# Altium project Luxlogger_V2.PrjPcb
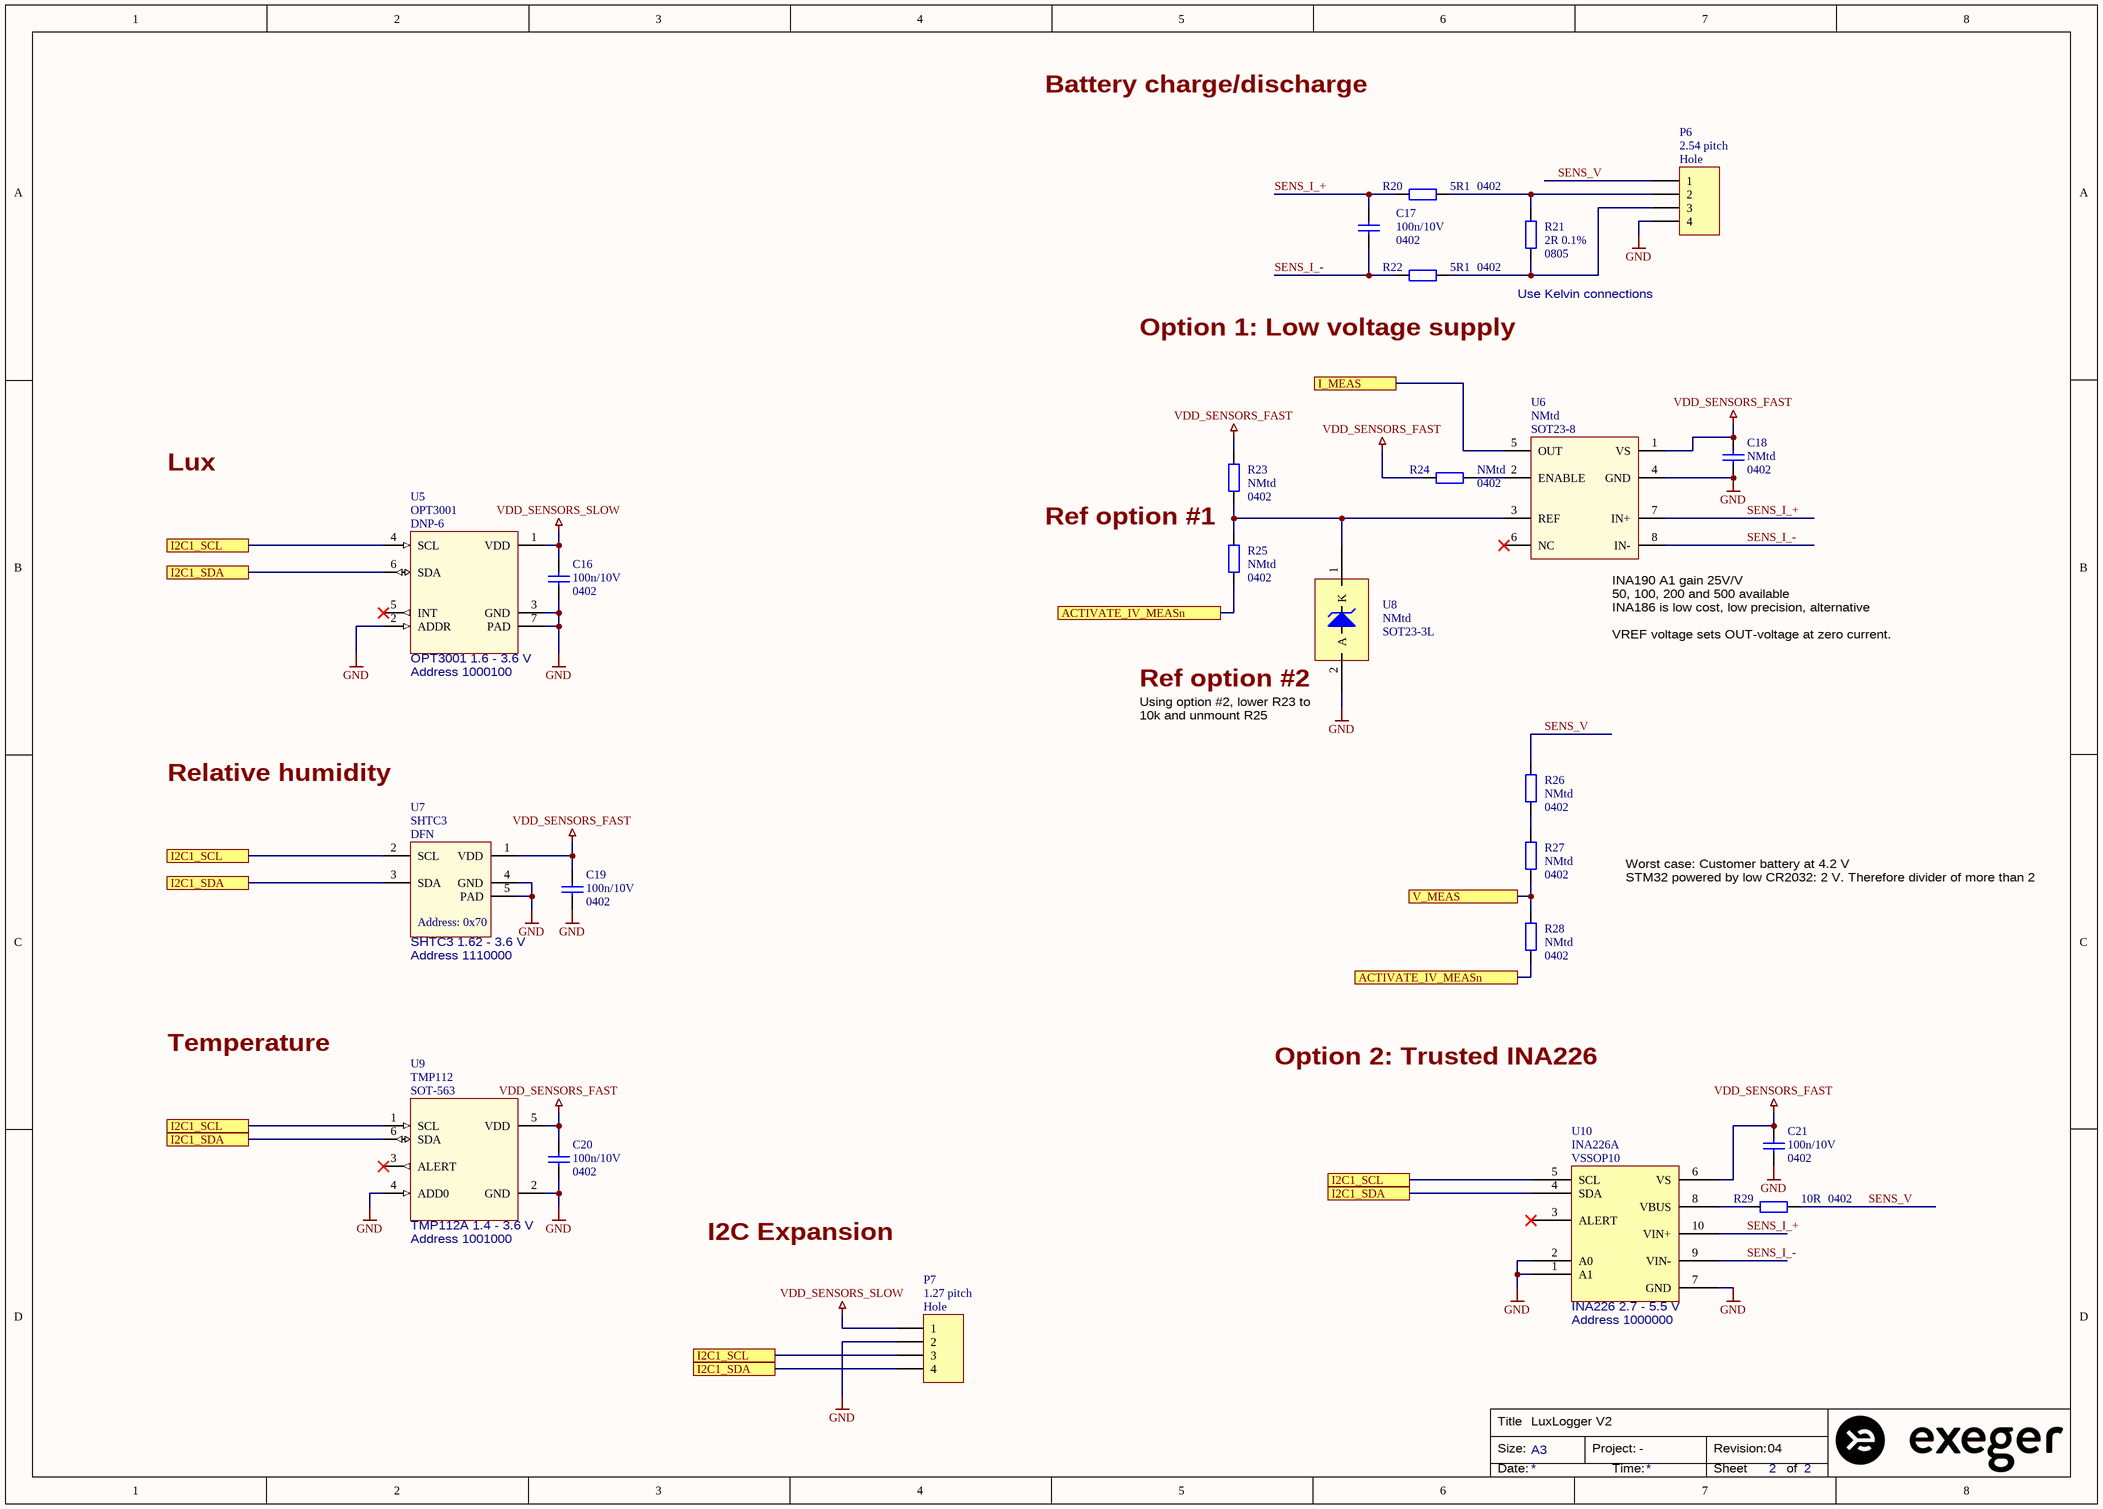
[diagram p0: LuxLogger_V2_sensors.SchDoc]
CompanyName: Exeger Operations AB; PROJ_Project: -; PROJ_Revision: 04; PROJ_Title: LuxLogger V2; Title: LuxLogger V2
1 sheet, 24 parts. Net scope: flat (ports and power ports of the same name join across sheets).
Board file: LuxLogger_V2_pcb.PcbDoc

## Sheet LuxLogger_V2_sensors.SchDoc: LuxLogger V2
size A3; Engineer: ChEn; SheetNumber: 2; SheetTotal: 2

### Parts
C16  Specification: 100n/10V  Package: 0402  [CAP0402]
C17  Specification: 100n/10V  Package: 0402  [CAP0402]
C18  Specification: NMtd  Package: 0402  [CAP0402]  (hidden comment: 100n/10V)
C19  Specification: 100n/10V  Package: 0402  [CAP0402]
C20  Specification: 100n/10V  Package: 0402  [CAP0402]
C21  Specification: 100n/10V  Package: 0402  [CAP0402]
P6  Specification: 2.54 pitch  Package: Hole  [Header 1x4 2.54]  (no BOM)
P7  Specification: 1.27 pitch  Package: Hole  [Header 1x4 1.27]  (no BOM)
R20  Package: 0402  Specification: 5R1  [RES0402]
R21  Package: 0805  Specification: 2R 0.1%  [RES0805]
R22  Package: 0402  Specification: 5R1  [RES0402]
R23  Package: 0402  Specification: NMtd  [RES0402]  (hidden comment: 100k 0.1%)
R24  Package: 0402  Specification: NMtd  [RES0402]  (hidden comment: 0R)
R25  Package: 0402  Specification: NMtd  [RES0402]  (hidden comment: 100k 0.1%)
R26  Package: 0402  Specification: NMtd  [RES0402]  (hidden comment: 10k 0.1%)
R27  Package: 0402  Specification: NMtd  [RES0402]  (hidden comment: 100k 0.1%)
R28  Package: 0402  Specification: NMtd  [RES0402]  (hidden comment: 100k 0.1%)
R29  Package: 0402  Specification: 10R  [RES0402]
U5  Package: DNP-6  [OPT3001]
U6  Specification: NMtd  [SOT23-8]
U7  Package: DFN  [SHTC3]
U8  Package: SOT23-3L  Specification: NMtd  [SOT23-3]
U9  Package: SOT-563  Specification: TMP112  [SOTFL50P160X60-6N]
U10  Package: VSSOP10  Specification: INA226A  [VSSOP-10]

### Ports
ACTIVATE_IV_MEASn, I2C1_SCL, I2C1_SDA, I_MEAS, V_MEAS

### Nets
GND: C16.1 C18.1 C19.1 C20.1 C21.1 P6.4 P7.2 U5.2(ADDR) U5.3(GND) U5.7(PAD) U6.4(GND) U7.4(GND) U7.5(PAD) U8.2(A) U9.2(GND) U9.4(ADD0) U10.1(A1) U10.2(A0) U10.7(GND)
VDD_SENSORS_FAST: C18.2 C19.2 C20.2 C21.2 R23.1 R24.2 U6.1(VS) U7.1(VDD) U9.5(VDD) U10.6(VS)
VDD_SENSORS_SLOW: C16.2 P7.1 U5.1(VDD)
ACTIVATE_IV_MEASn: R25.2 R28.2 ; port ACTIVATE_IV_MEASn
I2C1_SCL: P7.3 U5.4(SCL) U7.2(SCL) U9.1(SCL) U10.5(SCL) ; port I2C1_SCL
I2C1_SDA: P7.4 U5.6(SDA) U7.3(SDA) U9.6(SDA) U10.4(SDA) ; port I2C1_SDA
I_MEAS: U6.5(OUT) ; port I_MEAS
SENS_I_+: C17.2 R20.2 U6.7(IN+) U10.10(VIN+)
SENS_I_-: C17.1 R22.2 U6.8(IN-) U10.9(VIN-)
SENS_V: P6.1 R26.1 R29.1
V_MEAS: R27.2 R28.1 ; port V_MEAS
NetP6_2: P6.2 R20.1 R21.1
NetP6_3: P6.3 R21.2 R22.1
NetR23_2: R23.2 R25.1 U6.3(REF) U8.1(K)
NetR24_1: R24.1 U6.2(ENABLE)
NetR26_2: R26.2 R27.1
NetR29_2: R29.2 U10.8(VBUS)

Not connected (* = marked no-connect by the designer): U5 5(INT)*; U6 6(NC)*; U9 3(ALERT)*; U10 3(ALERT)*

### Notes on the sheet
- Battery charge/discharge
- (near R21) Use Kelvin connections
- (near R22) Option 1: Low voltage supply
- Lux
- Ref option #1
- (near U5) Address 1000100
- (near U5) OPT3001 1.6 - 3.6 V
- (near U8) Ref option #2
- (near U6) INA190 A1 gain 25V/V
  50, 100, 200 and 500 available
  INA186 is low cost, low precision, alternative
  VREF voltage sets OUT-voltage at zero current.
- Relative humidity
- (near U8) Using option #2, lower R23 to 10k and unmount R25
- (near U7) SHTC3 1.62 - 3.6 V
- Address 1110000
- Worst case: Customer battery at 4.2 V
  STM32 powered by low CR2032: 2 V. Therefore divider of more than 2
- Temperature
- Option 2: Trusted INA226
- (near U9) TMP112A 1.4 - 3.6 V
- (near U9) Address 1001000
- I2C Expansion
- (near U10) Address 1000000
- (near U10) INA226 2.7 - 5.5 V
- Title
- Size:
- A3
- Project:
- Revision:
- Date:
- Time:
- Sheet
- of
- (in symbol SHTC3) Address: 0x70

### Library data of the parts
C16-C21 = Cap: Capacitor
P6 P7 = Header 4: Header, 4-Pin
R20-R29 = Res2: Resistor
U5 = OPT3001: Lux sensor; Manufacturer: TI; Manufacturer PN: OPT3001DNP; Specification: OPT3001
U6 = INA190: Current amplifier; Manufacturer: TI; Manufacturer PN: INA190A1IDDF; Package: SOT23-8
U7 = SHTC3: SHTC3 RH sensor; Manufacturer: SENSIRION; Manufacturer PN: SHTC3; Specification: SHTC3
U8 = TS4061: Shunt voltage reference; Manufacturer PN: TS4061BILT-1.225; Manufacturer: ST
U9 = TMP112A: Temp_Sensor; Manufacturer: TI; Manufacturer PN: TMP112AIDR
U10 = INA226: Current and power monitor; Manufacturer PN: INA226AIDGS; Manufacturer: TI